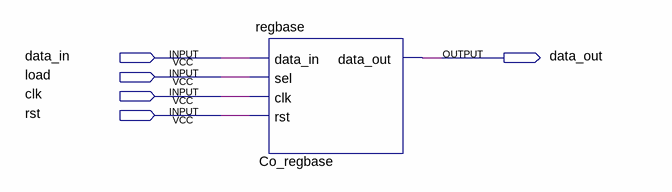
[diagram p0: schematic sheet]
// Quartus schematic register1bit.bdf as structural Verilog: 1 symbols, 5 pins
module register1bit (
  input  data_in,
  input  load,
  input  clk,
  input  rst,
  output data_out
);

  regbase Co_regbase (.data_in(data_in), .sel(load), .clk(clk), .rst(rst), .data_out(data_out));
endmodule
